# Altium project learn_2_stm32.PrjPCB
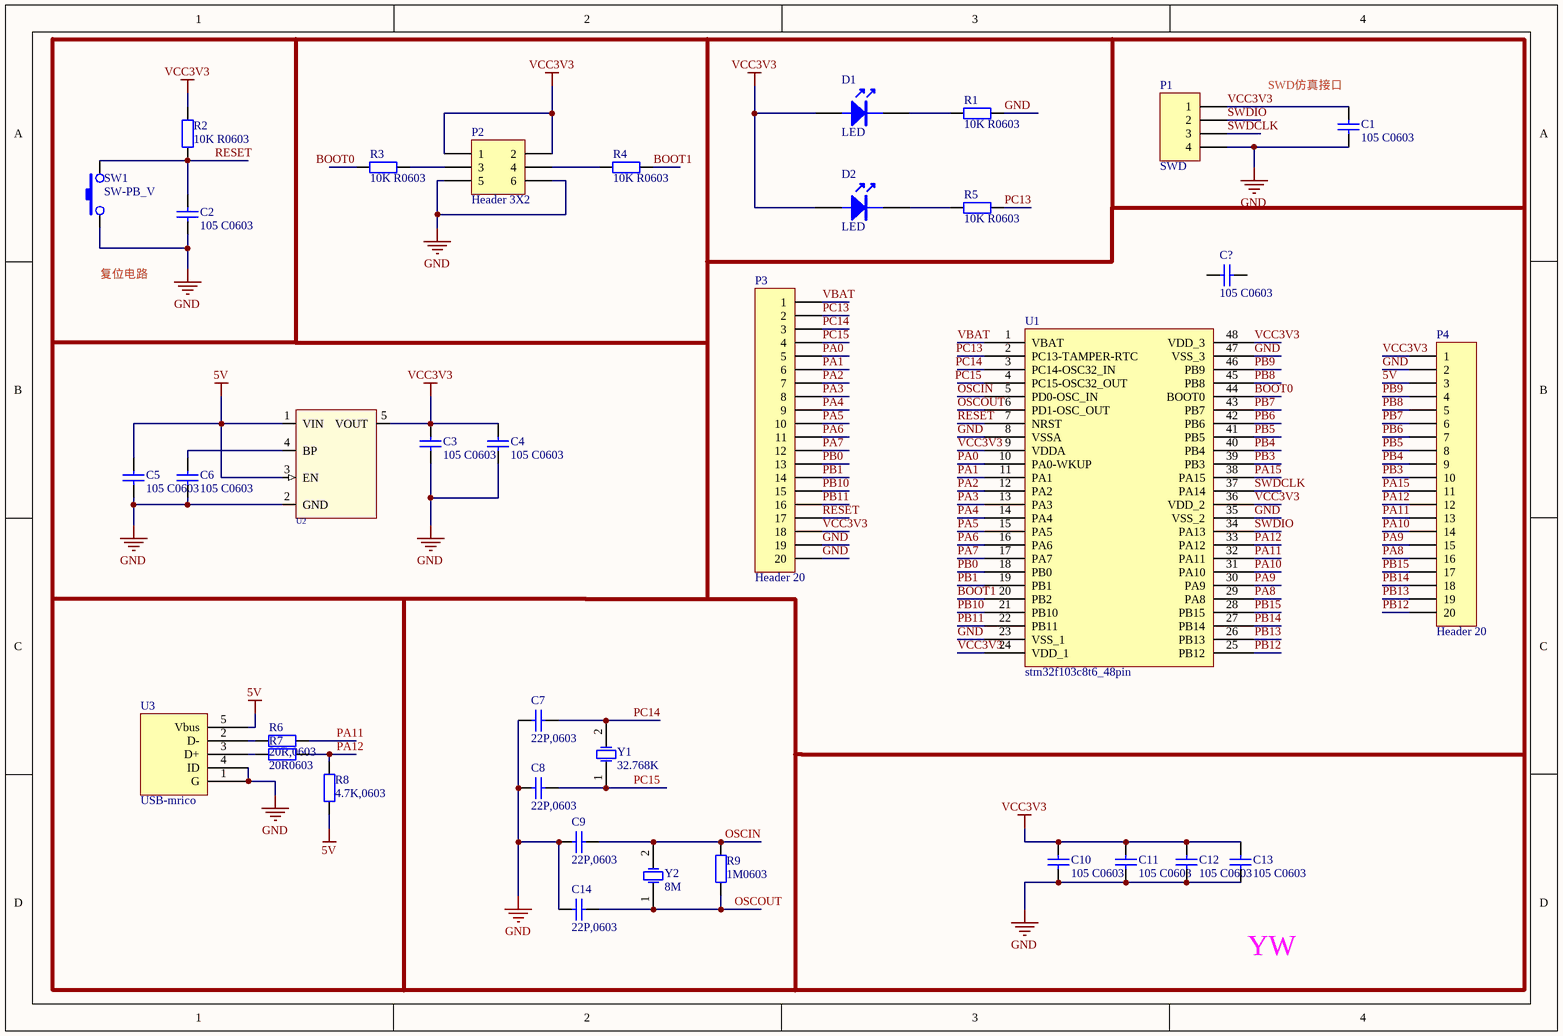
[diagram p0: learn_2.SchDoc]
1 sheet, 36 parts. Net scope: global (net labels, ports and power ports of the same name join across sheets).
Board file: learn_2.PcbDoc

## Sheet learn_2.SchDoc
size A4

### Parts
C1  105 C0603  [C 0603]
C2  105 C0603  [C 0603]
C3  105 C0603  [C 0603]
C4  105 C0603  [C 0603]
C5  105 C0603  [C 0603]
C6  105 C0603  [C 0603]
C7  22P,0603  [C 0603]
C8  22P,0603  [C 0603]
C9  22P,0603  [C 0603]
C10  105 C0603  [C 0603]
C11  105 C0603  [C 0603]
C12  105 C0603  [C 0603]
C13  105 C0603  [C 0603]
C14  22P,0603  [C 0603]
C?  105 C0603  [C 0603]
D1  LED  [LED 0805G]
D2  LED  [LED 0805G]
P1  SWD  [HDR-1X4_H]
P2  Header 3X2  [HDR-3X2]
P3  Header 20  [HDR1X20]
P4  Header 20  [HDR1X20]
R1  10K R0603  [R 0603]
R2  10K R0603  [R 0603]
R3  10K R0603  [R 0603]
R4  10K R0603  [R 0603]
R5  10K R0603  [R 0603]
R6  20R,0603  [R 0603]
R7  20R0603  [R 0603]
R8  4.7K,0603  [R 0603]
R9  1M0603  [R 0603]
SW1  SW-PB_V  [TSW SMD-3*6*2.5]
U1  stm32f103c8t6_48pin  [TQFP48 7x7_L]
U2  RT9193  [SOT23-5L]  (value not drawn)
U3  USB-mrico  [USB-micro_B]
Y1  32.768K  [XTAL-49S DIP]
Y2  8M  [XTAL-49S DIP]

### Nets
5V: C5.2 P4.3 R8.1 U2.1(VIN) U2.3(EN) U3.5(Vbus)
GND: C1.1 C2.1 C3.1 C4.1 C5.1 C6.1 C7.2 C8.2 C9.2 C10.1 C11.1 C12.1 C13.1 C14.2 P1.4 P2.5 P2.6 P3.19 P3.20 P4.2 R1.2 SW1.1 U1.8(VSSA) U1.23(VSS_1) U1.35(VSS_2) U1.47(VSS_3) U2.2(GND) U3.1(G) U3.4(ID)
VCC3V3: C1.2 C3.2 C4.2 C10.2 C11.2 C12.2 C13.2 D1.1 D2.1 P1.1 P2.1 P2.2 P3.18 P4.1 R2.2 U1.9(VDDA) U1.24(VDD_1) U1.36(VDD_2) U1.48(VDD_3) U2.5(VOUT)
BOOT0: R3.1 U1.44(BOOT0)
BOOT1: R4.2 U1.20(PB2)
OSCIN: C9.1 R9.2 U1.5(PD0-OSC_IN) Y2.2(OSC2)
OSCOUT: C14.1 R9.1 U1.6(PD1-OSC_OUT) Y2.1(OSC1)
PA0: P3.5 U1.10(PA0-WKUP)
PA1: P3.6 U1.11(PA1)
PA2: P3.7 U1.12(PA2)
PA3: P3.8 U1.13(PA3)
PA4: P3.9 U1.14(PA4)
PA5: P3.10 U1.15(PA5)
PA6: P3.11 U1.16(PA6)
PA7: P3.12 U1.17(PA7)
PA8: P4.16 U1.29(PA8)
PA9: P4.15 U1.30(PA9)
PA10: P4.14 U1.31(PA10)
PA11: P4.13 R6.2 U1.32(PA11)
PA12: P4.12 R7.2 R8.2 U1.33(PA12)
PA15: P4.11 U1.38(PA15)
PB0: P3.13 U1.18(PB0)
PB1: P3.14 U1.19(PB1)
PB3: P4.10 U1.39(PB3)
PB4: P4.9 U1.40(PB4)
PB5: P4.8 U1.41(PB5)
PB6: P4.7 U1.42(PB6)
PB7: P4.6 U1.43(PB7)
PB8: P4.5 U1.45(PB8)
PB9: P4.4 U1.46(PB9)
PB10: P3.15 U1.21(PB10)
PB11: P3.16 U1.22(PB11)
PB12: P4.20 U1.25(PB12)
PB13: P4.19 U1.26(PB13)
PB14: P4.18 U1.27(PB14)
PB15: P4.17 U1.28(PB15)
PC13: P3.2 R5.2 U1.2(PC13-TAMPER-RTC)
PC14: C7.1 P3.3 U1.3(PC14-OSC32_IN) Y1.2(OSC2)
PC15: C8.1 P3.4 U1.4(PC15-OSC32_OUT) Y1.1(OSC1)
RESET: C2.2 P3.17 R2.1 SW1.2 U1.7(NRST)
SWDCLK: P1.3 U1.37(PA14)
SWDIO: P1.2 U1.34(PA13)
VBAT: P3.1 U1.1(VBAT)
NetC6_2: C6.2 U2.4(BP)
NetD1_2: D1.2 R1.1
NetD2_2: D2.2 R5.1
NetP2_3: P2.3 R3.2
NetP2_4: P2.4 R4.1
NetR6_1: R6.1 U3.2(D-)
NetR7_1: R7.1 U3.3(D+)

Not connected (* = marked no-connect by the designer): C? 1 2

### Notes on the sheet
- SWD仿真接口
- 复位电路
- YW

### Library data of the parts
C1-C6 C10-C13 C? = Cap: Value: 104; Published: 8-Jun-2000; LatestRevisionDate: 17-Jul-2002; LatestRevisionNote: Re-released for DXP Platform.; Publisher: Altium Limited
C7-C9 C14 = Cap: Capacitor; Value: 104; Published: 8-Jun-2000; LatestRevisionDate: 17-Jul-2002; LatestRevisionNote: Re-released for DXP Platform.; Publisher: Altium Limited
P1 = Header 4: Header, 4-Pin; LatestRevisionDate: 17-Jul-2002; LatestRevisionNote: Re-released for DXP Platform.; Publisher: Altium Limited
P2 = Header 3X2: Header, 3-Pin, Dual row; LatestRevisionDate: 17-Jul-2002; LatestRevisionNote: Re-released for DXP Platform.; Publisher: Altium Limited
P3 P4 = Header 20: Header, 20-Pin; LatestRevisionDate: 17-Jul-2002; LatestRevisionNote: Re-released for DXP Platform.; Publisher: Altium Limited
R1-R5 = Res2: Published: 8-Jun-2000; LatestRevisionDate: 17-Jul-2002; LatestRevisionNote: Re-released for DXP Platform.; Publisher: Altium Limited
R6-R9 = Res2: Resistor; Published: 8-Jun-2000; LatestRevisionDate: 17-Jul-2002; LatestRevisionNote: Re-released for DXP Platform.; Publisher: Altium Limited
U2 = RT9193X_5P: ICA_MFR_NAME: RICHTEK; ICA_PARTNUM: $$2191094$$RT9193-15CU5; Part Number: TMP-13
U3 = usb-STM
Y1 Y2 = XTAL: Crystal Oscillator; Published: 8-Jun-2000; LatestRevisionDate: 17-Jul-2002; LatestRevisionNote: Re-released for DXP Platform.; Publisher: Altium Limited